# EAGLE design Electronic Design (EAGLE 8.1.1)
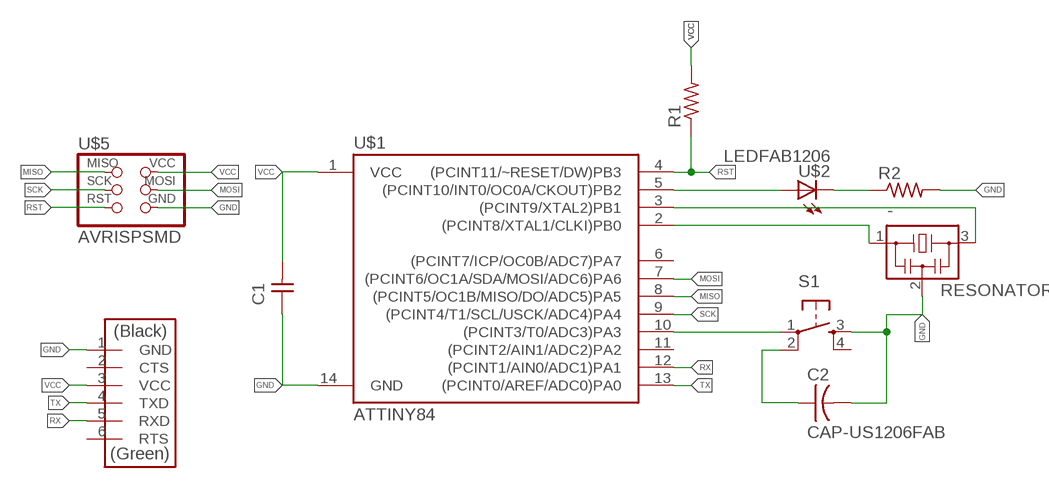
[diagram p0: schematic, sheet 1]

## Parts
-  RESONATOR  [EFOBM]
C1  CAP-UNPOLARIZEDFAB  [C1206FAB]
C2  CAP-US1206FAB  [C1206FAB]
R1  RES-US1206FAB  [R1206FAB]
R2  RES-US1206FAB  [R1206FAB]
S1  6MM_SWITCH6MM_SWITCH  [6MM_SWITCH]
U$1  ATTINY84  [SO14]
U$2  LEDFAB1206  [LED1206FAB]
U$3  FTDI-SMD-HEADER  [1X06SMD]
U$5  AVRISPSMD  [2X03SMD]

## Nets
BUTTON: C2.1 S1.2(P1)
GND: -.2 C1.1 C2.2 R2.2 S1.3(S) U$1.14(GND) U$3.1(GND) U$5.6(GND)
MISO: U$1.8((PCINT5/OC1B/MISO/DO/ADC5)PA5) U$5.1(MISO)
MOSI: U$1.7((PCINT6/OC1A/SDA/MOSI/ADC6)PA6) U$5.4(MOSI)
N$1: R2.1 U$2.2(C)
N$2: U$1.5((PCINT10/INT0/OC0A/CKOUT)PB2) U$2.1(A)
N$3: S1.1(P) U$1.10((PCINT3/T0/ADC3)PA3)
RST: R1.1 U$1.4((PCINT11/~RESET/DW)PB3) U$5.5(RST)
RX: U$1.12((PCINT1/AIN0/ADC1)PA1) U$3.5(RXD)
SCK: U$1.9((PCINT4/T1/SCL/USCK/ADC4)PA4) U$5.3(SCK)
TX: U$1.13((PCINT0/AREF/ADC0)PA0) U$3.4(TXD)
VCC: C1.2 R1.2 U$1.1(VCC) U$3.3(VCC) U$5.2(VCC)
XTAL1: -.1 U$1.2((PCINT8/XTAL1/CLKI)PB0)
XTAL2: -.3 U$1.3((PCINT9/XTAL2)PB1)
Unconnected: S1.4(S1) U$1.6((PCINT7/ICP/OC0B/ADC7)PA7) U$1.11((PCINT2/AIN1/ADC2)PA2) U$3.2(CTS) U$3.6(RTS)

## Library data of the parts
- = fab:RESONATOR
C1 = fab:CAP-UNPOLARIZED
C2 = fab:CAP-US
R1 R2 = fab:RES-US: Resistor (US Symbol) Variants with postfix FAB are widened to allow the routing of internal traces
S1 = fab:6MM_SWITCH: OMRON SWITCH
U$1 = SparkFun-DigitalIC:ATTINY84: Atmel 14-pin 2/4/8kB flash uC; PROD_ID: IC-11285
U$2 = fab:LED: LED
U$3 = fab:FTDI-SMD-HEADER
U$5 = fab:AVRISP

## Board
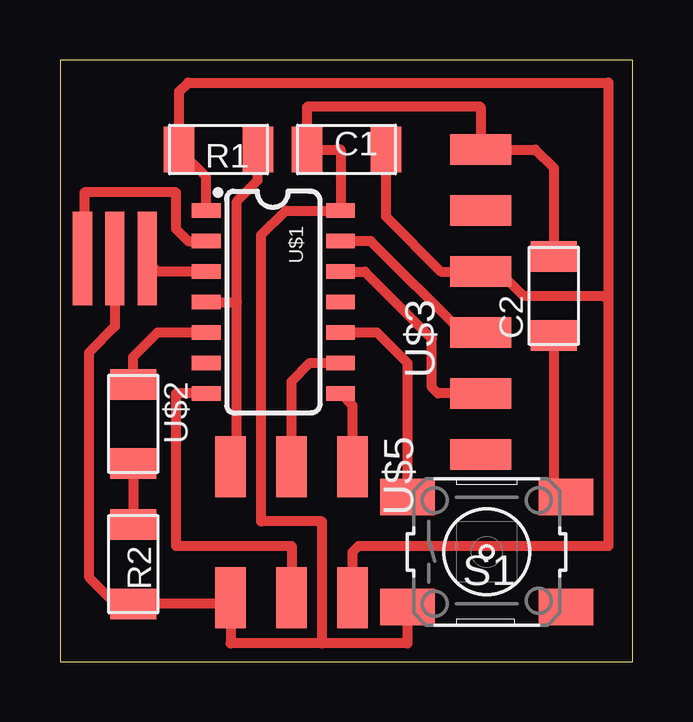
[diagram p1: board, top side]

Size 23.86 x 25.07 mm. Coordinates in mm from the lower left corner, seen from the top.
Outline: 0,0 23.86,0 23.86,25.07 0,25.07 0,0
Copper layers (1*16): Top 0.035mm / dielectric 1.5mm / Bottom 0.035mm
Design rules "default *": minimum track width 10mil, minimum drill 24mil, track to track 16mil, track to pad 16mil, pad to pad 16mil, via to via 8mil, smd to smd 16mil, copper to edge 16mil, drill to drill 8mil, minimum pad ring 10mil, minimum via ring 8mil, stop-mask expansion 4mil, vias tented up to drill 0mil, thermal gap 10mil

### Footprints (pad centres in the part's own frame; a part is rotated, then mirrored left to right if it is on the bottom)
EFOBM = smd 0.8 x 3.9: 1 -1.35,0; 2 0,0; 3 1.35,0
C1206FAB = smd 1.27 x 1.905: 1 -1.651,0; 2 1.651,0
R1206FAB = smd 1.27 x 1.905: 1 -1.651,0; 2 1.651,0
6MM_SWITCH = smd 2.286 x 1.524: 1 -3.302,2.286; 2 3.302,2.286; 3 -3.302,-2.286; 4 3.302,-2.286
SO14 = smd 0.6 x 1.2: 1 -3.81,-2.8; 2 -2.54,-2.8; 3 -1.27,-2.8; 4 0,-2.8; 5 1.27,-2.8; 6 2.54,-2.8; 7 3.81,-2.8; 8 3.81,2.8; 9 2.54,2.8; 10 1.27,2.8; 11 0,2.8; 12 -1.27,2.8; 13 -2.54,2.8; 14 -3.81,2.8
LED1206FAB = smd 1.27 x 1.905: 1 -1.651,0; 2 1.651,0
1X06SMD = smd 2.54 x 1.27: 1 0,6.35; 2 0,3.81; 3 0,1.27; 4 0,-1.27; 5 0,-3.81; 6 0,-6.35
2X03SMD = smd 2.54 x 1.27: 1 -2.54,2.54; 2 2.92,2.54; 3 -2.54,0; 4 2.92,0; 5 -2.54,-2.54; 6 2.92,-2.54

### Placement (x,y rotation side)
-  2.29,16.8 0 top
C1  11.94,21.34 0 top
C2  20.57,15.24 90 top
R1  6.6,21.34 180 top
R2  3.05,4.06 270 top
S1  17.78,4.57 0 top
U$1  8.89,14.99 270 top
U$2  3.05,9.91 270 top
U$3  17.53,14.99 0 top
U$5  9.65,5.59 270 top

### Tracks (layer width: path | path; a pad name or v marks a point on that pad's centre or on a via)
BUTTON
  Top 0.406: C2.1 20.57,7.37 S1.2
GND
  Top 0.406: 10.92,0.76 10.92,5.84 8.38,5.84 8.38,17.78 9.4,18.8 U$1.14 11.69,21.34 C1.1 10.29,23.11 17.53,23.11 U$3.1 19.81,21.34 20.57,20.57 C2.2 | 10.92,0.76 7.11,0.76 U$5.6 | 7.37,3.68 7.37,3.3 7.11,3.3 U$5.6 | S1.3 14.48,0.76 10.92,0.76 | U$5.6 6.86,2.41 R2.2 2.31,2.41 1.22,3.5 1.22,12.9 2.29,13.97 -.2
MISO
  Top 0.406: U$5.1 12.19,10.67 U$1.8
MOSI
  Top 0.406: U$1.7 4.83,11.18 4.83,4.83 9.65,4.83 U$5.4
N$1
  Top 0.406: U$2.2 R2.1
N$2
  Top 0.406: U$2.1 3.05,12.7 4.06,13.72 U$1.5
N$3
  Top 0.406: U$1.10 13.21,13.72 14.48,12.45 S1.1
RST
  Top 0.406: 8.38,21.34 R1.1 8.24,21.32 8.24,20.05 7.37,19.18 7.37,14.99 | U$5.5 7.37,8.13 7.37,14.99 | U$1.4 7.37,14.99
RX
  Top 0.406: U$1.12 12.7,16.26 15.49,13.46 15.49,11.43 15.75,11.18 U$3.5
SCK
  Top 0.406: U$1.9 10.41,12.45 9.65,11.68 U$5.3
TX
  Top 0.406: 17.27,13.72 U$3.4 16.76,13.72 12.95,17.53 U$1.13
VCC
  Top 0.406: U$5.2 12.19,4.57 12.45,4.83 22.86,4.83 22.86,15.23 | 17.53,16 U$3.3 | 22.86,15.23 22.86,24.13 5.33,24.13 4.95,23.75 R1.2 | 22.64,15.21 22.61,15.24 19.3,15.24 18.81,15.74 | R1.2 4.95,21.31 5.06,21.21 | C1.2 13.59,18.54 15.88,16.26 U$3.3 | U$3.3 | U$3.3 18.29,16.26 18.81,15.74 | R1.2 6.09,20.2 U$1.1 | 22.86,15.23 19.31,15.23 18.81,15.74
XTAL1
  Top 0.406: U$1.2 5.33,17.53 4.83,18.03 4.83,19.56 1.02,19.56 1.02,17.1 -.1
XTAL2
  Top 0.406: 6.09,16.18 U$1.3 4.06,16.26 3.81,16.51 3.81,16.94 -.3